# Altium schematic sheet isoJTAG.SchDoc
size A4; Organization: UltraZohm; SheetNumber: 31; SheetTotal: 40
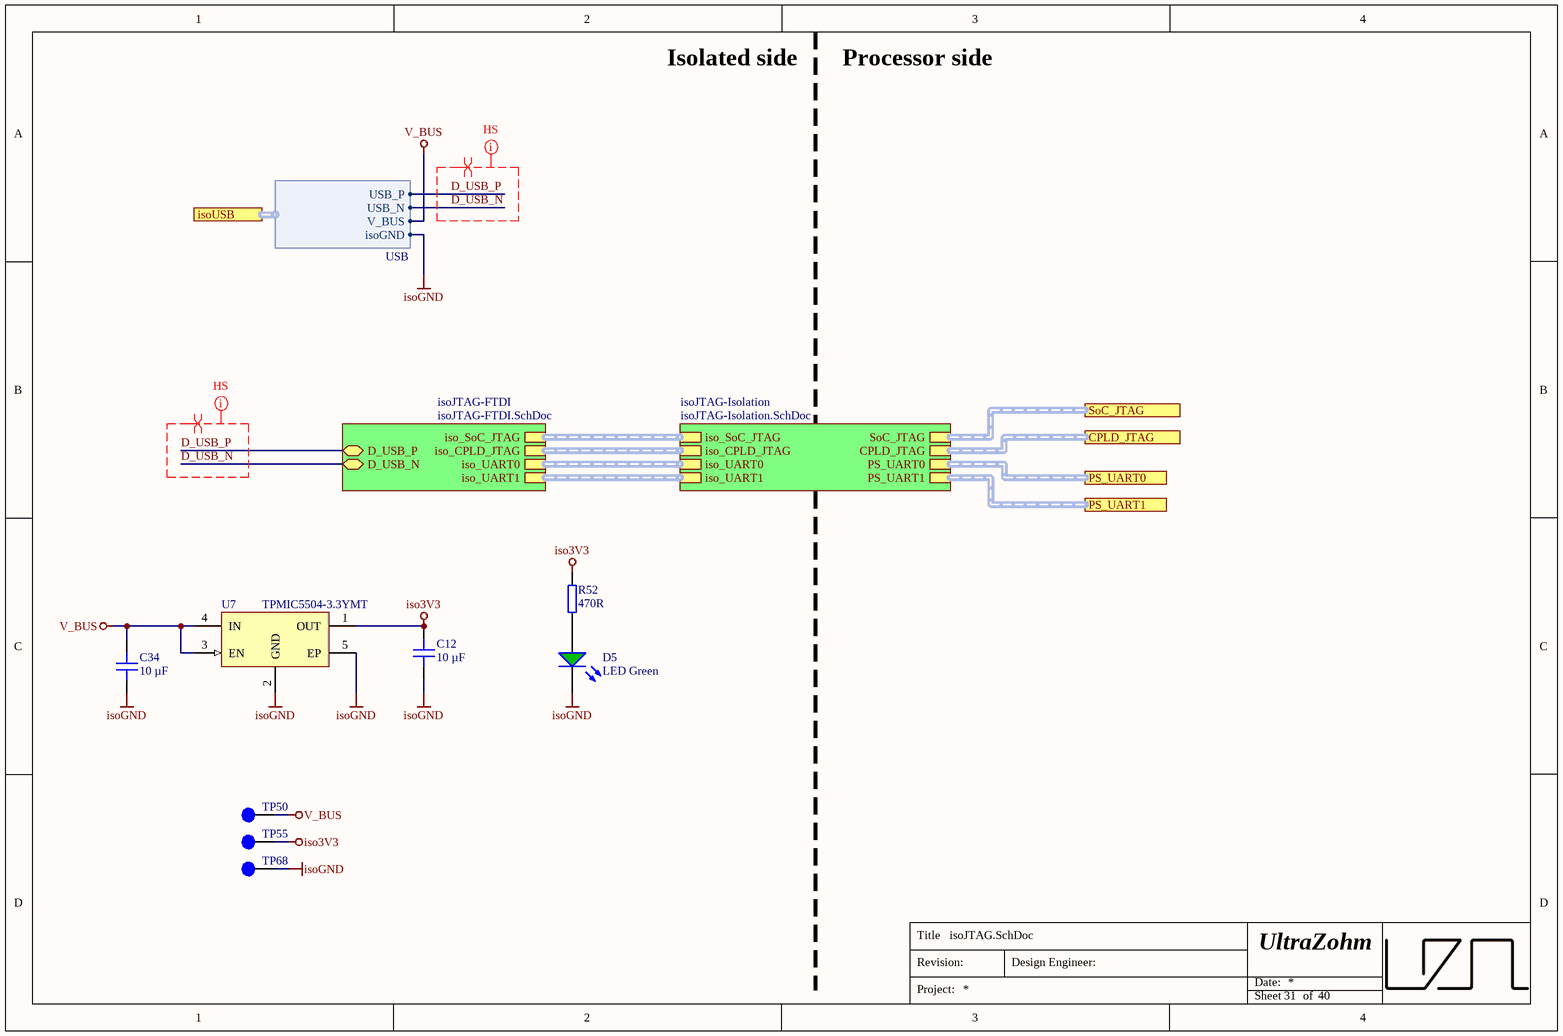
[diagram p0: isoJTAG.SchDoc]

## Parts
C12  10 µF  [C_0603]
C34  10 µF  [C_0603]
D5  LED Green  [WL-SMCW_0603]
R52  470R  [R_0603_TE]
TP50  Testpoint 1mm  [TP_1mm]  (value not drawn)  (no BOM)
TP55  Testpoint 1mm  [TP_1mm]  (value not drawn)  (no BOM)
TP68  Testpoint 1mm  [TP_1mm]  (value not drawn)  (no BOM)
U7  TPMIC5504-3.3YMT  [DFN-4-EP]

## Sub-sheets
isoJTAG-FTDI = isoJTAG-FTDI.SchDoc: iso_SoC_JTAG (harness JTAG), iso_CPLD_JTAG (harness JTAG), iso_UART0 (harness UART), iso_UART1 (harness UART), D_USB_P (bidir), D_USB_N (bidir)
isoJTAG-Isolation = isoJTAG-Isolation.SchDoc: iso_SoC_JTAG (harness JTAG), iso_CPLD_JTAG (harness JTAG), iso_UART0 (harness UART), iso_UART1 (harness UART), SoC_JTAG (harness JTAG), CPLD_JTAG (harness JTAG), PS_UART0 (harness UART), PS_UART1 (harness UART)

## Ports
CPLD_JTAG (harness JTAG), isoUSB (harness USB), PS_UART0 (harness UART), PS_UART1 (harness UART), SoC_JTAG (harness JTAG)

## Harnesses
USB: USB_P, USB_N, V_BUS, isoGND

## Nets
iso3V3: C12.2 R52.2 TP55.1 U7.1(OUT)
isoGND: C12.1 C34.1 D5.1(K) TP68.1 U7.2(GND) U7.5(EP) ; port isoUSB.isoGND
V_BUS: C34.2 TP50.1 U7.3(EN) U7.4(IN) ; port isoUSB.V_BUS
D_USB_N: sheet isoJTAG-FTDI/D_USB_N, port isoUSB.USB_N
D_USB_P: sheet isoJTAG-FTDI/D_USB_P, port isoUSB.USB_P
NetD5_2: D5.2(A) R52.1

## Buses and harness runs
harness port CPLD_JTAG = sheet isoJTAG-Isolation/CPLD_JTAG
harness port PS_UART0 = sheet isoJTAG-Isolation/PS_UART0
harness port PS_UART1 = sheet isoJTAG-Isolation/PS_UART1
harness port SoC_JTAG = sheet isoJTAG-Isolation/SoC_JTAG
harness sheet isoJTAG-FTDI/iso_CPLD_JTAG = sheet isoJTAG-Isolation/iso_CPLD_JTAG
harness sheet isoJTAG-FTDI/iso_SoC_JTAG = sheet isoJTAG-Isolation/iso_SoC_JTAG
harness sheet isoJTAG-FTDI/iso_UART0 = sheet isoJTAG-Isolation/iso_UART0
harness sheet isoJTAG-FTDI/iso_UART1 = sheet isoJTAG-Isolation/iso_UART1

## Layout directives
differential pair: D_USB_N, D_USB_P
net class HS: D_USB_N, D_USB_P

## Notes on the sheet
- Isolated side
- Processor side
- Title
- Revision:
- Design Engineer:
- Date:
- Project:
- Sheet
- of

## Library data of the parts
C12 C34 = CL10A106MO8NQNC: Capacitor 0603, 16 VDC, 10 µF, X5R; Manufacturer: Samsung Electro-Mechanics; Tolerance: 20 %; Voltage Rating: 16 VDC; Created from: AGeiger; Manufacturer Part Number: CL10A106MO8NQNC; PartID: 101; Created On: 22.08.2022 13:56:44; ComponentLink1Description: Datasheet; ComponentLink1URL: https://datasheet.lcsc.com/lcsc/1810261909_Samsung-Electro-Mechanics-CL10A106MO8NQNC_C92487.pdf; Component Type: Capacitor 0603; Device Package: 0603; Last Updated: 03.09.2022 10:50:43; Mounting Type: SMD; Operating Temperature: -55 - 85°C; Series: X5R; Supplier 1: LCSC; Supplier Part Number 1: C92487; Type: Capacitor; Value: 10 µF; Live Cycle Status: 1; LCSC Part Number: C92487
D5 = UZgen_LED_0603_Green: Standard LEDs - SMD 0603 green; Manufacturer: UZgen; Created from: UZgenTool; Manufacturer Part Number: UZgen_LED_0603_Green; PartID: 21; Created On: 09/09/2024 10:45:01; ComponentLink1Description: N/A; ComponentLink1URL: N/A; Component Type: LED Diode; Device Package: 0603; Last Updated: 09/09/2024 10:45:01; Mounting Type: SMD; Supplier 1: LCSC; Supplier Part Number 1: =LCSC Part Number; Type: Standard; Live Cycle Status: 1; Stock number: not stored; Color: green; Value: LED Green
R52 = UZgen_R_0603_470R: Generic resistor; Manufacturer: UZgen; Tolerance: 1 %; Created from: UZgenTool; Manufacturer Part Number: UZgen_R_0603_470R; PartID: 213; Created On: 02/07/2024 17:29:49; Device Package: 0603; Last Updated: 02/07/2024 17:29:49; Mounting Type: SMD; Value: 470R
TP50 TP55 TP68 = NULL: Manufacturer Part Number: NULL; Created from: AGeiger; Created: 2018_06_25_AGeiger; Value: Testpoint 1mm; PartID: 9; Created On: 20.09.2022 13:14:57; Component Type: Testpoint; Last Updated: 20.09.2022 13:15:39; Manufacturer: NULL; Supplier 1: NULL; Supplier Part Number 1: NULL; Type: Testpoint; Live Cycle Status: 1
U7 = TPMIC5504-3.3YMT: DFN-4-EP(1x1) Linear Voltage Regulators (LDO) ROHS; Manufacturer: TECH PUBLIC; Value: 3.3 V; Created from: AGeiger; Manufacturer Part Number: TPMIC5504-3.3YMT; PartID: 15; Created On: 26.11.2023 13:32:42; ComponentLink1Description: Datasheet; ComponentLink1URL: https://datasheet.lcsc.com/lcsc/2205241716_TECH-PUBLIC-TPMIC5504-3-3YMT_C3021135.pdf; Component Type: LDO; Device Package: SMD; Last Updated: 26.11.2023 13:32:42; Mounting Type: SMD; Operating Temperature: -40 to 125 °C; Series: TPMIC5504; Supplier 1: LCSC; Supplier Part Number 1: C3021135; Type: LDO; Live Cycle Status: 1; LCSC Part Number: C3021135; Stock number: not stored